# Altium schematic sheet X10-Isolation.SchDoc
size A4; SheetNumber: 23
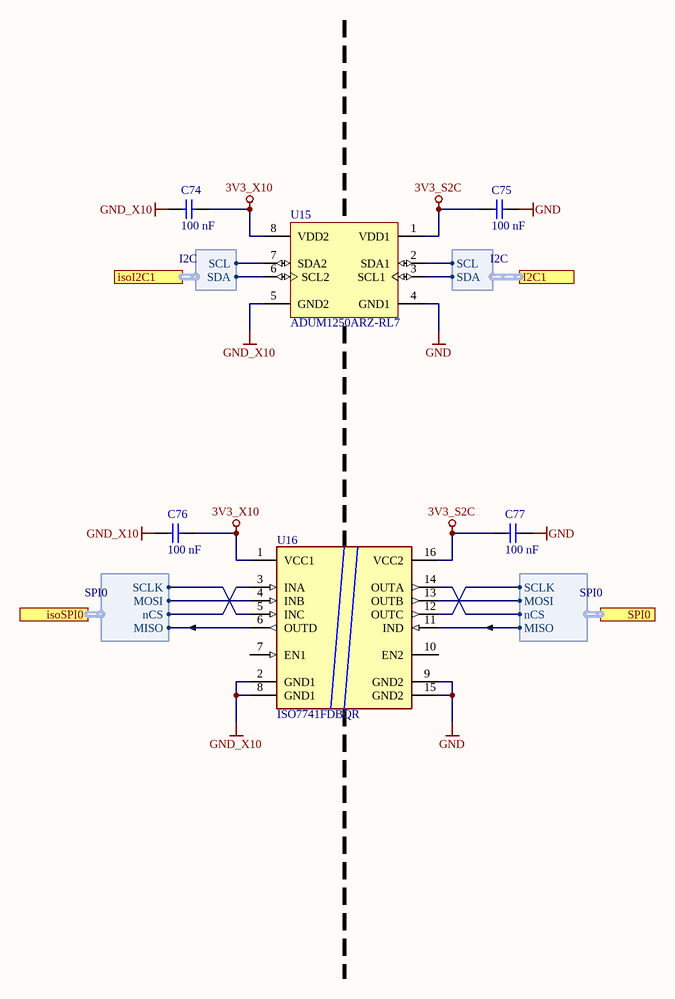
[diagram p0: X10-Isolation.SchDoc]

## Parts
C74  100 nF  [C_0603_TE]
C75  100 nF  [C_0603_TE]
C76  100 nF  [C_0603_TE]
C77  100 nF  [C_0603_TE]
U15  ADUM1250ARZ-RL7  [ADI-R-8_N]
U16  ISO7741FDBQR  [SOP64P600X175-16N]

## Ports
I2C1 (harness I2C), isoI2C1 (harness I2C), isoSPI0 (harness SPI0), SPI0 (harness SPI0)

## Harnesses
I2C: SCL, SDA
SPI0: SCLK, MOSI, MISO, nCS

## Nets
3V3_S2C: C75.2 C77.2 U15.1(VDD1) U16.16(VCC2)
3V3_X10: C74.1 C76.1 U15.8(VDD2) U16.1(VCC1)
GND: C75.1 C77.1 U15.4(GND1) U16.9(GND2) U16.15(GND2)
GND_X10: C74.2 C76.2 U15.5(GND2) U16.2(GND1) U16.8(GND1)
NetU15_2: U15.2(SDA1) ; port I2C1.SCL
NetU15_3: U15.3(SCL1) ; port I2C1.SDA
NetU15_6: U15.6(SCL2) ; port isoI2C1.SDA
NetU15_7: U15.7(SDA2) ; port isoI2C1.SCL
NetU16_3: U16.3(INA) ; port isoSPI0.nCS
NetU16_4: U16.4(INB) ; port isoSPI0.MOSI
NetU16_5: U16.5(INC) ; port isoSPI0.SCLK
NetU16_6: U16.6(OUTD) ; port isoSPI0.MISO
NetU16_11: U16.11(IND) ; port SPI0.MISO
NetU16_12: U16.12(OUTC) ; port SPI0.SCLK
NetU16_13: U16.13(OUTB) ; port SPI0.MOSI
NetU16_14: U16.14(OUTA) ; port SPI0.nCS

Not connected (* = marked no-connect by the designer): U16 7(EN1) 10(EN2)

## Notes on the sheet
- Title
- Revision:
- Design Engineer:
- Date:
- Project:
- Sheet
- of

## Library data of the parts
C74-C77 = UZgen_C_0603_100nF_50V_X7R: Generic capacitor; Manufacturer: UZgen; Voltage: 50V; Tolerance: 10 %; Created from: AGeiger; Manufacturer Part Number: UZgen_C_0603_100nF_50V_X7R; PartID: 1; Created On: 02/07/2024 14:42:23; Value: 100 nF; Device Package: 0603; Technology: X7R; Mounting Type: SMD; Last Updated: 08/08/2024 15:01:15
U15 = ADUM1250ARZ-RL7: Digital Isolators DUAL-Hot-Swappable 12C Isolators; Manufacturer: Analog Devices Inc.; Created from: FRosner; ComponentLink1Description: Datasheet; ComponentLink2URL: http://www.analog.com/media/en/technical-documentation/data-sheets/ADUM1250_1251.pdf; ComponentLink1URL: https://www.mouser.de/ProductDetail/Analog-Devices/ADUM1250ARZ-RL7?qs=WIvQP4zGangN4422brPwNw%3D%3D; ComponentLink2Description: Datasheet; Manufacturer Part Number: ADUM1250ARZ-RL7; PartID: 4; Created On: 11/06/2024 20:40:52; Component Type: Digital Isolator; Device Package: SOIC-8; Last Updated: 12/07/2024 08:56:06; Mounting Type: SMD; Supplier 1: Mouser; Supplier Part Number 1: 584-ADUM1250ARZ-R7; Supplier 2: LCSC; Supplier Part Number 2: C13839; Type: Digital Isolator; Live Cycle Status: 1; LCSC Part Number: C13839; Stock number: not stored
U16 = ISO7741FDBQR: ISO774xT-Q1 High-Speed, Reinforced Quad-Channel Digital Isolators With Integrated; Manufacturer: Texas Instruments; Created from: FRosner; Manufacturer Part Number: ISO7741FDBQR; PartID: 9; Created On: 23/02/2025 18:08:33; ComponentLink1Description: Datasheet; ComponentLink1URL: https://www.ti.com/lit/ds/symlink/iso7741.pdf; Component Type: Digital Isolator; Device Package: SSOP-16; Last Updated: 26/03/2025 16:07:30; Mounting Type: SMD; Operating Temperature: -55 to +125 °C; Series: ISO7741; Supplier 1: Mouser; Supplier Part Number 1: 595-ISO7741FDBQR; Supplier 2: LCSC; Supplier Part Number 2: C2872241; Type: Digital Isolator; Value: ISO7741FDBQR; LCSC Part Number: C2872241